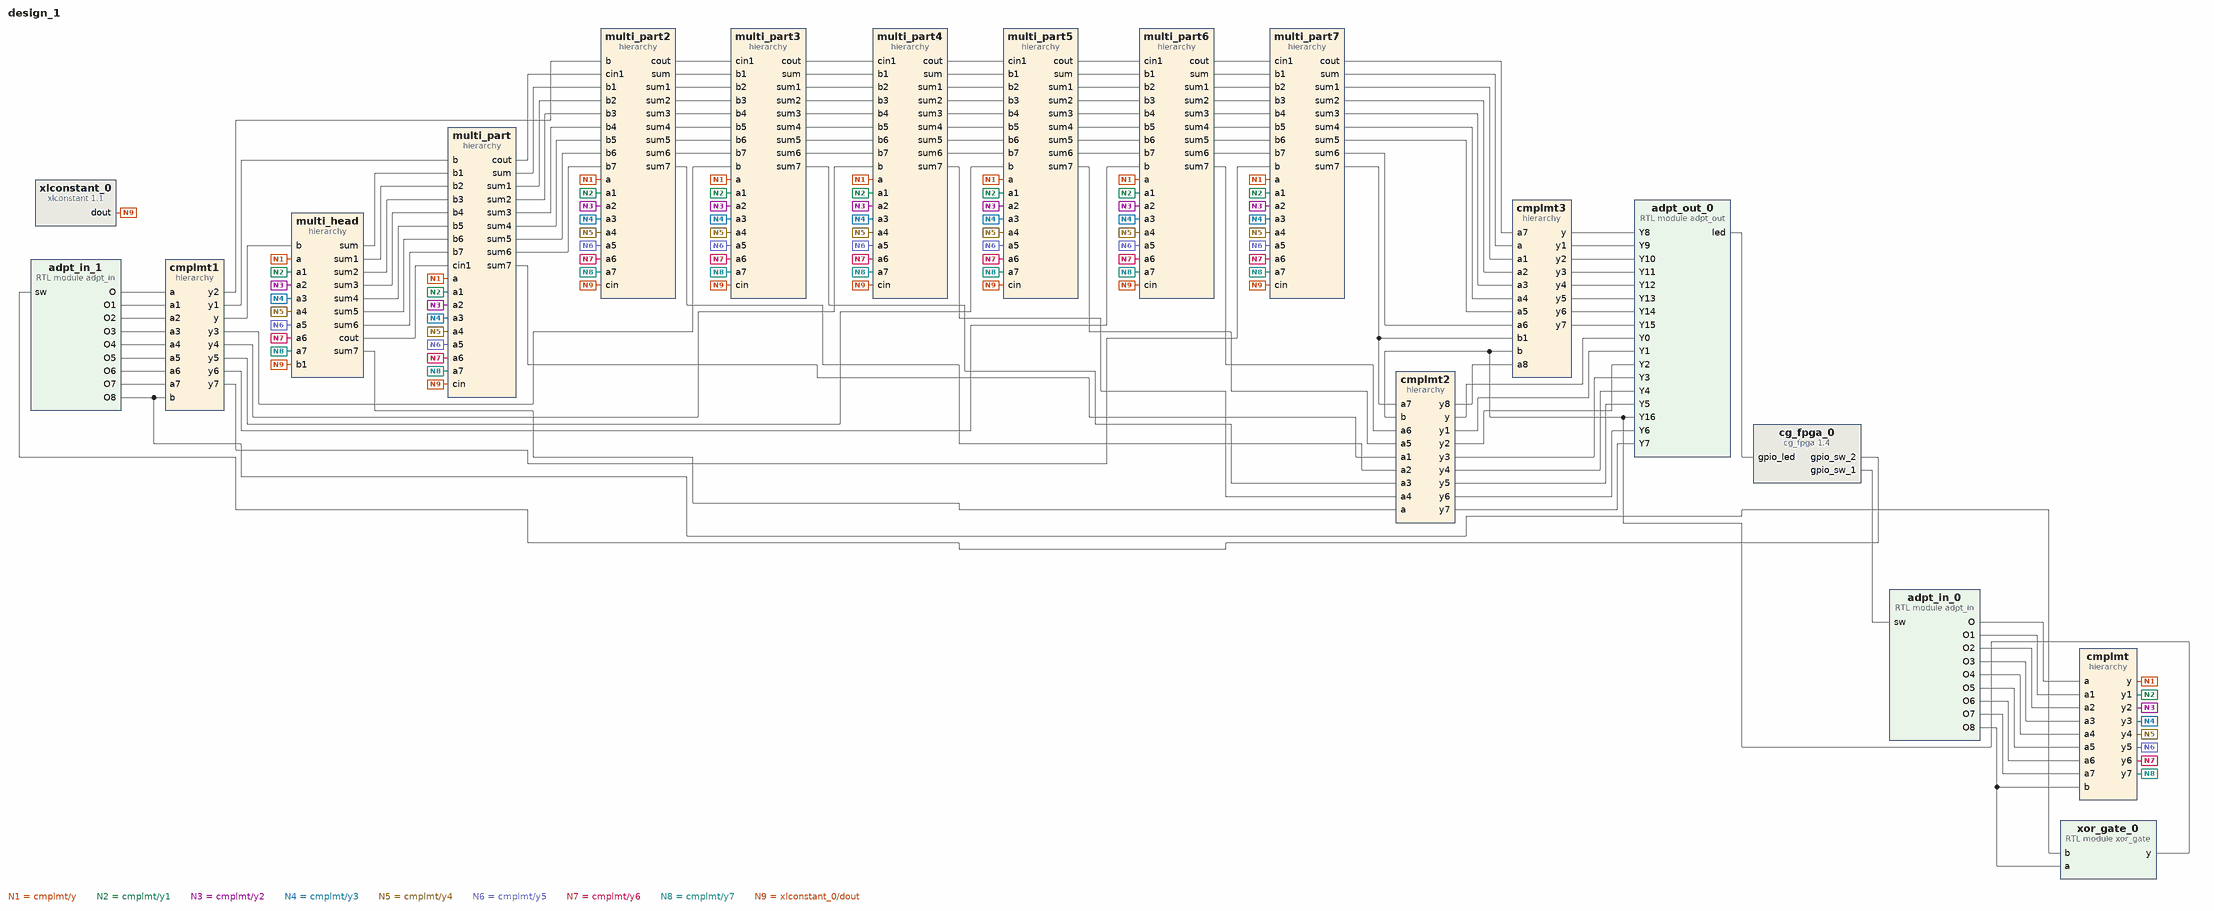
[diagram p0: block diagram of the top level]
# Vivado block design design_1, xc7z020clg400-1, Vivado 2024.2
create_bd_design design_1

create_bd_cell -type ip -vlnv educg.net:user:cg_fpga:1.4 cg_fpga_0
create_bd_cell -type module -reference adpt_in adpt_in_0
create_bd_cell -type module -reference adpt_in adpt_in_1
create_bd_cell -type hier cmplmt
create_bd_cell -type hier cmplmt1
create_bd_cell -type ip -vlnv xilinx.com:ip:xlconstant:1.1 xlconstant_0
set_property -dict {CONFIG.CONST_VAL 0} [get_bd_cells xlconstant_0]
create_bd_cell -type hier multi_part
create_bd_cell -type hier multi_head
create_bd_cell -type hier multi_part2
create_bd_cell -type hier multi_part3
create_bd_cell -type hier multi_part4
create_bd_cell -type hier multi_part5
create_bd_cell -type hier multi_part6
create_bd_cell -type hier multi_part7
create_bd_cell -type module -reference xor_gate xor_gate_0
create_bd_cell -type module -reference adpt_out adpt_out_0
create_bd_cell -type hier cmplmt2
create_bd_cell -type hier cmplmt3

# ---- hierarchy /cmplmt ----
current_bd_instance /cmplmt
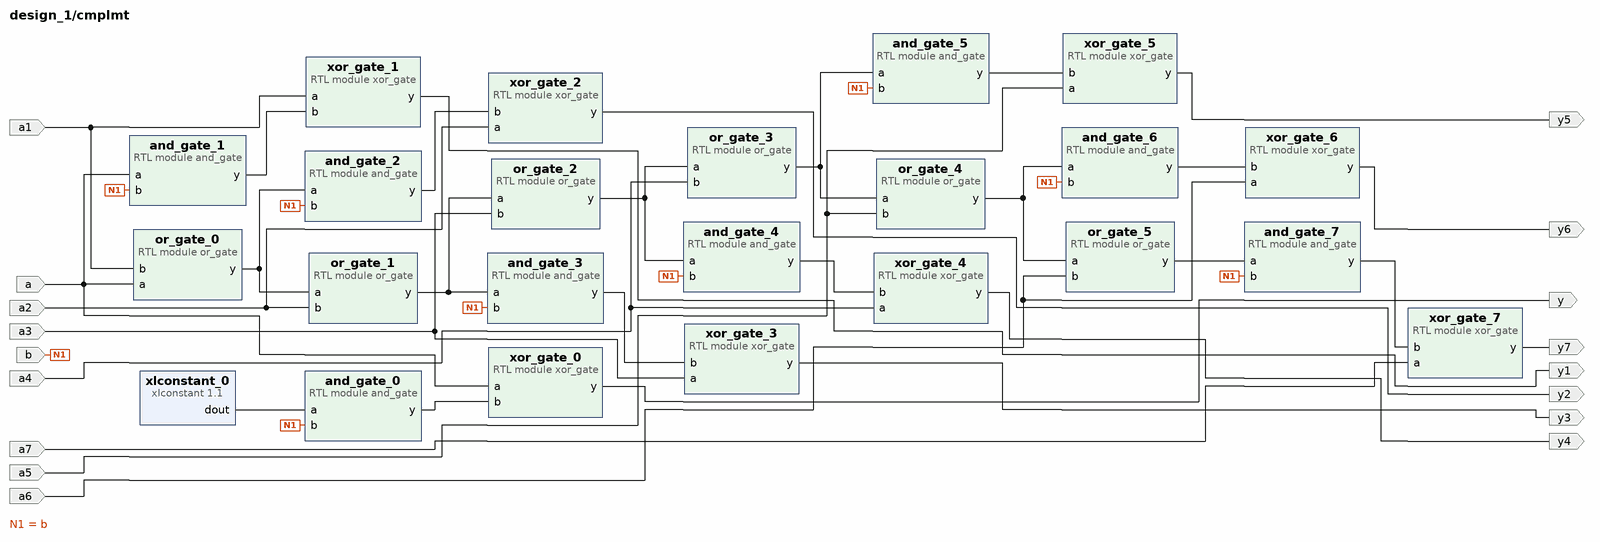
[diagram p1: block diagram inside /cmplmt]
create_bd_pin -dir I a
create_bd_pin -dir I a1
create_bd_pin -dir I a2
create_bd_pin -dir I a3
create_bd_pin -dir I a4
create_bd_pin -dir I a5
create_bd_pin -dir I b
create_bd_pin -dir I a6
create_bd_pin -dir I a7
create_bd_pin -dir O y
create_bd_pin -dir O y1
create_bd_pin -dir O y2
create_bd_pin -dir O y3
create_bd_pin -dir O y4
create_bd_pin -dir O y5
create_bd_pin -dir O y6
create_bd_pin -dir O y7

create_bd_cell -type ip -vlnv xilinx.com:ip:xlconstant:1.1 xlconstant_0
set_property -dict {CONFIG.CONST_VAL 0} [get_bd_cells xlconstant_0]
create_bd_cell -type module -reference or_gate or_gate_0
create_bd_cell -type module -reference or_gate or_gate_1
create_bd_cell -type module -reference or_gate or_gate_2
create_bd_cell -type module -reference or_gate or_gate_3
create_bd_cell -type module -reference or_gate or_gate_4
create_bd_cell -type module -reference and_gate and_gate_1
create_bd_cell -type module -reference and_gate and_gate_2
create_bd_cell -type module -reference and_gate and_gate_3
create_bd_cell -type module -reference and_gate and_gate_4
create_bd_cell -type module -reference and_gate and_gate_5
create_bd_cell -type module -reference and_gate and_gate_6
create_bd_cell -type module -reference xor_gate xor_gate_0
create_bd_cell -type module -reference xor_gate xor_gate_1
create_bd_cell -type module -reference xor_gate xor_gate_2
create_bd_cell -type module -reference xor_gate xor_gate_3
create_bd_cell -type module -reference xor_gate xor_gate_4
create_bd_cell -type module -reference xor_gate xor_gate_5
create_bd_cell -type module -reference xor_gate xor_gate_6
create_bd_cell -type module -reference xor_gate xor_gate_7
create_bd_cell -type module -reference or_gate or_gate_5
create_bd_cell -type module -reference and_gate and_gate_7
create_bd_cell -type module -reference and_gate and_gate_0

# ---- hierarchy /cmplmt1 ----
current_bd_instance /cmplmt1
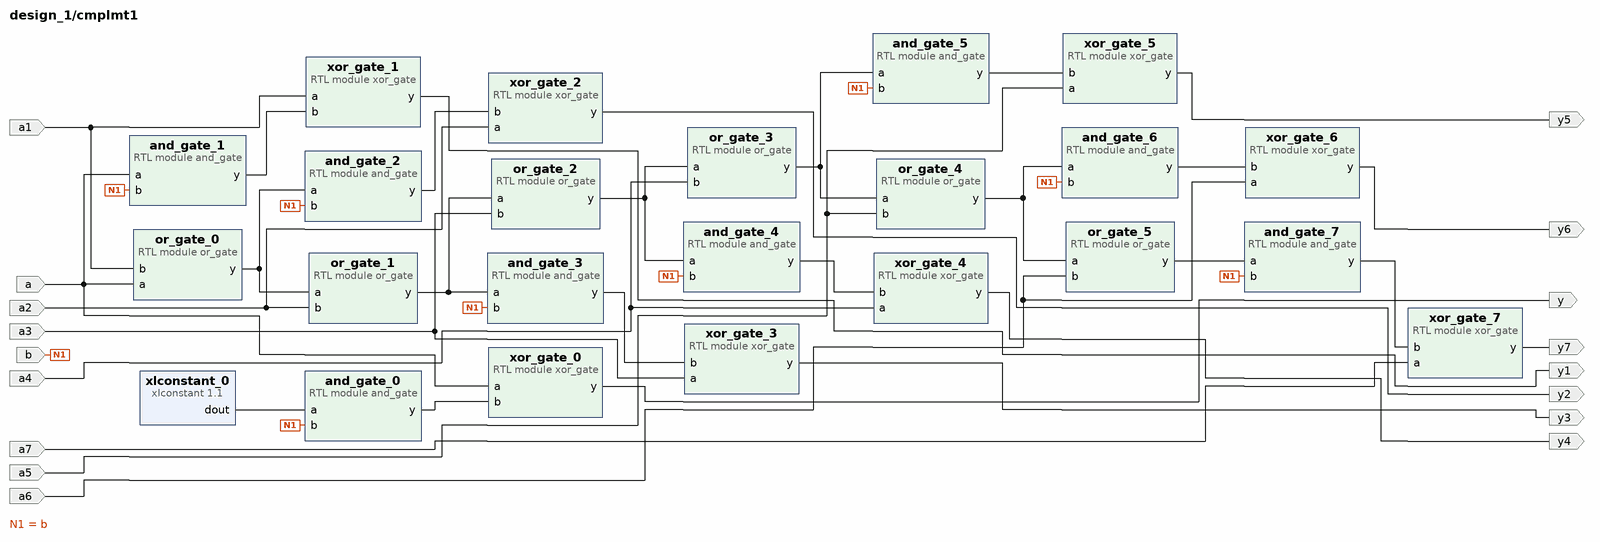
[diagram p2: block diagram inside /cmplmt1]
create_bd_pin -dir I a
create_bd_pin -dir I a1
create_bd_pin -dir I a2
create_bd_pin -dir I a3
create_bd_pin -dir I a4
create_bd_pin -dir I a5
create_bd_pin -dir I b
create_bd_pin -dir I a6
create_bd_pin -dir I a7
create_bd_pin -dir O y
create_bd_pin -dir O y1
create_bd_pin -dir O y2
create_bd_pin -dir O y3
create_bd_pin -dir O y4
create_bd_pin -dir O y5
create_bd_pin -dir O y6
create_bd_pin -dir O y7

create_bd_cell -type ip -vlnv xilinx.com:ip:xlconstant:1.1 xlconstant_0
set_property -dict {CONFIG.CONST_VAL 0} [get_bd_cells xlconstant_0]
create_bd_cell -type module -reference or_gate or_gate_0
create_bd_cell -type module -reference or_gate or_gate_1
create_bd_cell -type module -reference or_gate or_gate_2
create_bd_cell -type module -reference or_gate or_gate_3
create_bd_cell -type module -reference or_gate or_gate_4
create_bd_cell -type module -reference and_gate and_gate_1
create_bd_cell -type module -reference and_gate and_gate_2
create_bd_cell -type module -reference and_gate and_gate_3
create_bd_cell -type module -reference and_gate and_gate_4
create_bd_cell -type module -reference and_gate and_gate_5
create_bd_cell -type module -reference and_gate and_gate_6
create_bd_cell -type module -reference xor_gate xor_gate_0
create_bd_cell -type module -reference xor_gate xor_gate_1
create_bd_cell -type module -reference xor_gate xor_gate_2
create_bd_cell -type module -reference xor_gate xor_gate_3
create_bd_cell -type module -reference xor_gate xor_gate_4
create_bd_cell -type module -reference xor_gate xor_gate_5
create_bd_cell -type module -reference xor_gate xor_gate_6
create_bd_cell -type module -reference xor_gate xor_gate_7
create_bd_cell -type module -reference or_gate or_gate_5
create_bd_cell -type module -reference and_gate and_gate_7
create_bd_cell -type module -reference and_gate and_gate_0

# ---- hierarchy /multi_part ----
current_bd_instance /multi_part
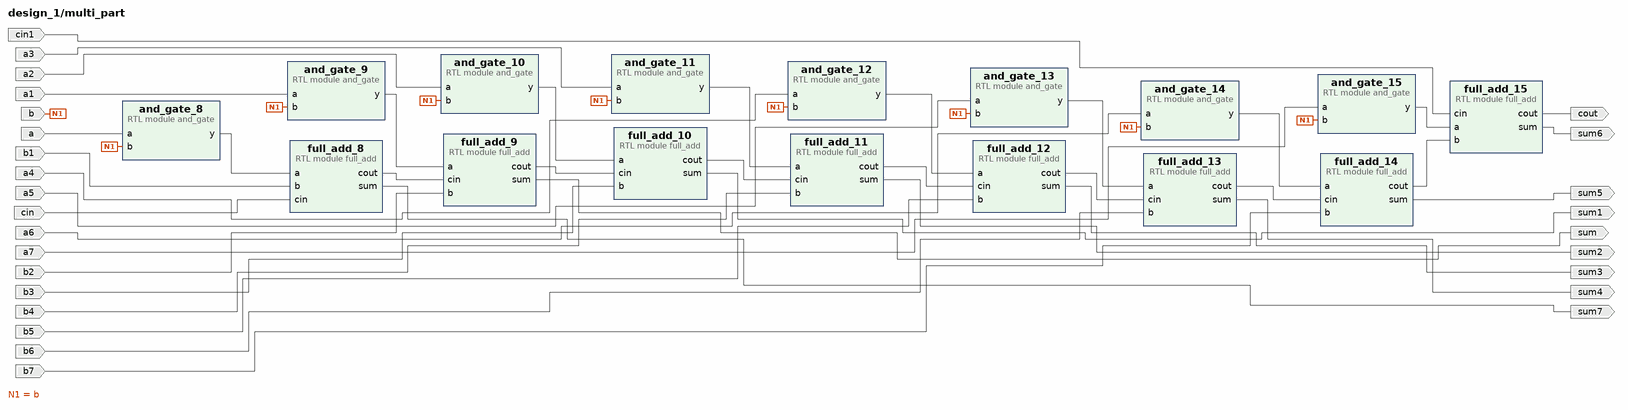
[diagram p3: block diagram inside /multi_part]
create_bd_pin -dir I a
create_bd_pin -dir I b
create_bd_pin -dir I a1
create_bd_pin -dir I a2
create_bd_pin -dir I a3
create_bd_pin -dir I a4
create_bd_pin -dir I a5
create_bd_pin -dir I a6
create_bd_pin -dir I a7
create_bd_pin -dir I b1
create_bd_pin -dir I cin
create_bd_pin -dir I b2
create_bd_pin -dir I b3
create_bd_pin -dir I b4
create_bd_pin -dir I b5
create_bd_pin -dir I b6
create_bd_pin -dir I b7
create_bd_pin -dir O sum
create_bd_pin -dir O sum1
create_bd_pin -dir O sum2
create_bd_pin -dir O sum3
create_bd_pin -dir O sum4
create_bd_pin -dir O sum5
create_bd_pin -dir O sum6
create_bd_pin -dir O cout
create_bd_pin -dir I cin1
create_bd_pin -dir O sum7

create_bd_cell -type module -reference and_gate and_gate_8
create_bd_cell -type module -reference and_gate and_gate_9
create_bd_cell -type module -reference and_gate and_gate_10
create_bd_cell -type module -reference and_gate and_gate_11
create_bd_cell -type module -reference and_gate and_gate_12
create_bd_cell -type module -reference and_gate and_gate_13
create_bd_cell -type module -reference and_gate and_gate_14
create_bd_cell -type module -reference and_gate and_gate_15
create_bd_cell -type module -reference full_add full_add_8
create_bd_cell -type module -reference full_add full_add_9
create_bd_cell -type module -reference full_add full_add_10
create_bd_cell -type module -reference full_add full_add_11
create_bd_cell -type module -reference full_add full_add_12
create_bd_cell -type module -reference full_add full_add_13
create_bd_cell -type module -reference full_add full_add_14
create_bd_cell -type module -reference full_add full_add_15

# ---- hierarchy /multi_head ----
current_bd_instance /multi_head
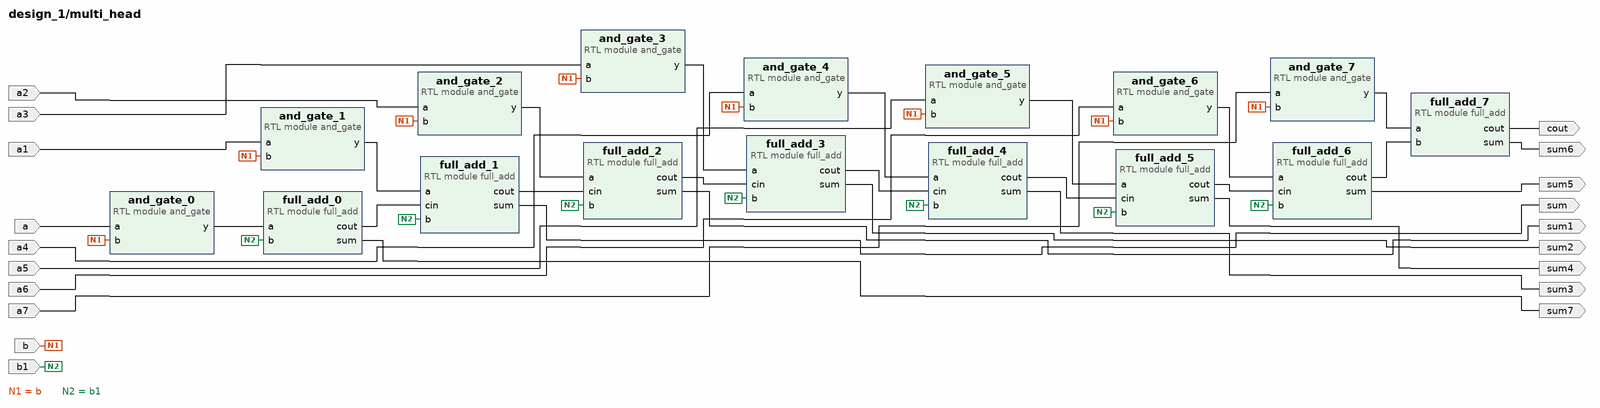
[diagram p4: block diagram inside /multi_head]
create_bd_pin -dir I a
create_bd_pin -dir I b
create_bd_pin -dir I a1
create_bd_pin -dir I a2
create_bd_pin -dir I a3
create_bd_pin -dir I a4
create_bd_pin -dir I a5
create_bd_pin -dir I a6
create_bd_pin -dir I a7
create_bd_pin -dir I b1
create_bd_pin -dir O sum
create_bd_pin -dir O sum1
create_bd_pin -dir O sum2
create_bd_pin -dir O sum3
create_bd_pin -dir O sum4
create_bd_pin -dir O sum5
create_bd_pin -dir O sum6
create_bd_pin -dir O cout
create_bd_pin -dir O sum7

create_bd_cell -type module -reference and_gate and_gate_0
create_bd_cell -type module -reference and_gate and_gate_1
create_bd_cell -type module -reference and_gate and_gate_2
create_bd_cell -type module -reference and_gate and_gate_3
create_bd_cell -type module -reference and_gate and_gate_4
create_bd_cell -type module -reference and_gate and_gate_5
create_bd_cell -type module -reference and_gate and_gate_6
create_bd_cell -type module -reference and_gate and_gate_7
create_bd_cell -type module -reference full_add full_add_0
create_bd_cell -type module -reference full_add full_add_1
create_bd_cell -type module -reference full_add full_add_2
create_bd_cell -type module -reference full_add full_add_3
create_bd_cell -type module -reference full_add full_add_4
create_bd_cell -type module -reference full_add full_add_5
create_bd_cell -type module -reference full_add full_add_6
create_bd_cell -type module -reference full_add full_add_7

# ---- hierarchy /multi_part2 ----
current_bd_instance /multi_part2
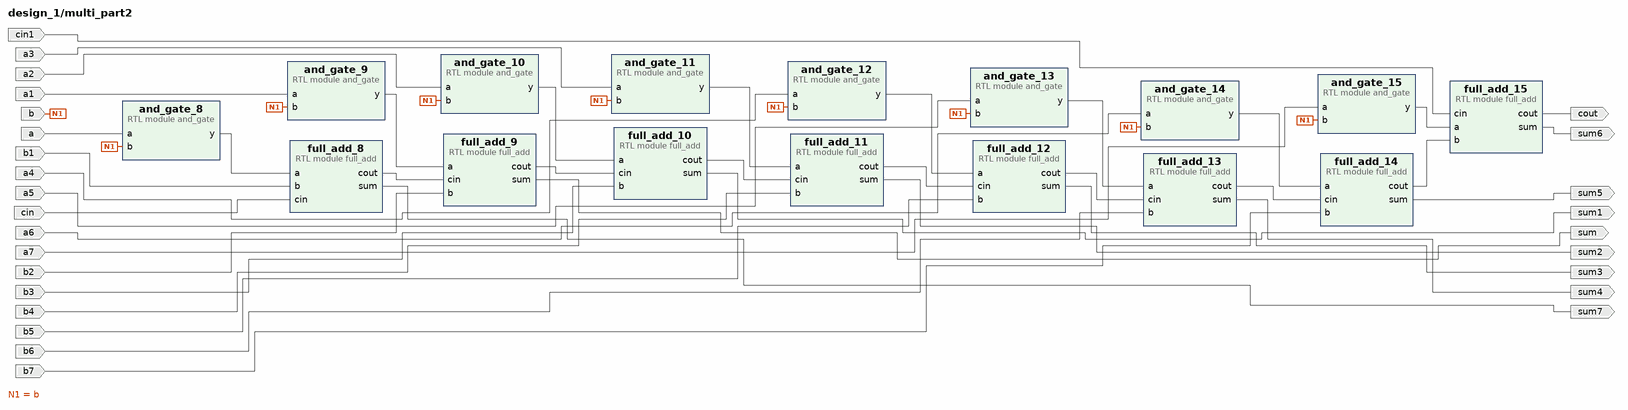
[diagram p5: block diagram inside /multi_part2]
create_bd_pin -dir I a
create_bd_pin -dir I b
create_bd_pin -dir I a1
create_bd_pin -dir I a2
create_bd_pin -dir I a3
create_bd_pin -dir I a4
create_bd_pin -dir I a5
create_bd_pin -dir I a6
create_bd_pin -dir I a7
create_bd_pin -dir I b1
create_bd_pin -dir I cin
create_bd_pin -dir I b2
create_bd_pin -dir I b3
create_bd_pin -dir I b4
create_bd_pin -dir I b5
create_bd_pin -dir I b6
create_bd_pin -dir I b7
create_bd_pin -dir O sum
create_bd_pin -dir O sum1
create_bd_pin -dir O sum2
create_bd_pin -dir O sum3
create_bd_pin -dir O sum4
create_bd_pin -dir O sum5
create_bd_pin -dir O sum6
create_bd_pin -dir O cout
create_bd_pin -dir I cin1
create_bd_pin -dir O sum7

create_bd_cell -type module -reference and_gate and_gate_8
create_bd_cell -type module -reference and_gate and_gate_9
create_bd_cell -type module -reference and_gate and_gate_10
create_bd_cell -type module -reference and_gate and_gate_11
create_bd_cell -type module -reference and_gate and_gate_12
create_bd_cell -type module -reference and_gate and_gate_13
create_bd_cell -type module -reference and_gate and_gate_14
create_bd_cell -type module -reference and_gate and_gate_15
create_bd_cell -type module -reference full_add full_add_8
create_bd_cell -type module -reference full_add full_add_9
create_bd_cell -type module -reference full_add full_add_10
create_bd_cell -type module -reference full_add full_add_11
create_bd_cell -type module -reference full_add full_add_12
create_bd_cell -type module -reference full_add full_add_13
create_bd_cell -type module -reference full_add full_add_14
create_bd_cell -type module -reference full_add full_add_15

# ---- hierarchy /multi_part3 ----
current_bd_instance /multi_part3
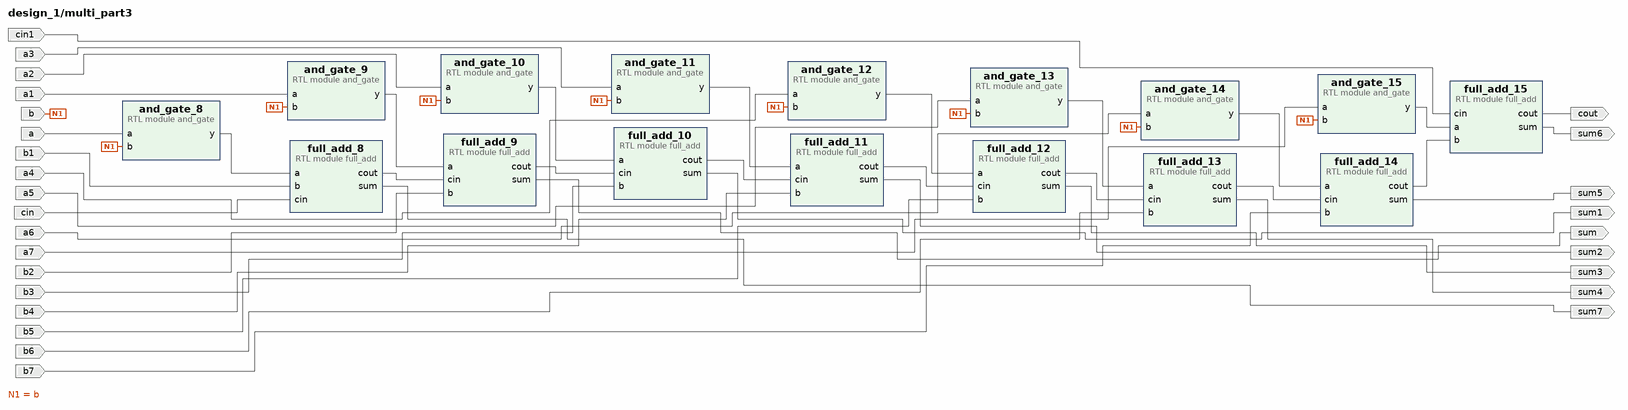
[diagram p6: block diagram inside /multi_part3]
create_bd_pin -dir I a
create_bd_pin -dir I b
create_bd_pin -dir I a1
create_bd_pin -dir I a2
create_bd_pin -dir I a3
create_bd_pin -dir I a4
create_bd_pin -dir I a5
create_bd_pin -dir I a6
create_bd_pin -dir I a7
create_bd_pin -dir I b1
create_bd_pin -dir I cin
create_bd_pin -dir I b2
create_bd_pin -dir I b3
create_bd_pin -dir I b4
create_bd_pin -dir I b5
create_bd_pin -dir I b6
create_bd_pin -dir I b7
create_bd_pin -dir O sum
create_bd_pin -dir O sum1
create_bd_pin -dir O sum2
create_bd_pin -dir O sum3
create_bd_pin -dir O sum4
create_bd_pin -dir O sum5
create_bd_pin -dir O sum6
create_bd_pin -dir O cout
create_bd_pin -dir I cin1
create_bd_pin -dir O sum7

create_bd_cell -type module -reference and_gate and_gate_8
create_bd_cell -type module -reference and_gate and_gate_9
create_bd_cell -type module -reference and_gate and_gate_10
create_bd_cell -type module -reference and_gate and_gate_11
create_bd_cell -type module -reference and_gate and_gate_12
create_bd_cell -type module -reference and_gate and_gate_13
create_bd_cell -type module -reference and_gate and_gate_14
create_bd_cell -type module -reference and_gate and_gate_15
create_bd_cell -type module -reference full_add full_add_8
create_bd_cell -type module -reference full_add full_add_9
create_bd_cell -type module -reference full_add full_add_10
create_bd_cell -type module -reference full_add full_add_11
create_bd_cell -type module -reference full_add full_add_12
create_bd_cell -type module -reference full_add full_add_13
create_bd_cell -type module -reference full_add full_add_14
create_bd_cell -type module -reference full_add full_add_15

# ---- hierarchy /multi_part4 ----
current_bd_instance /multi_part4
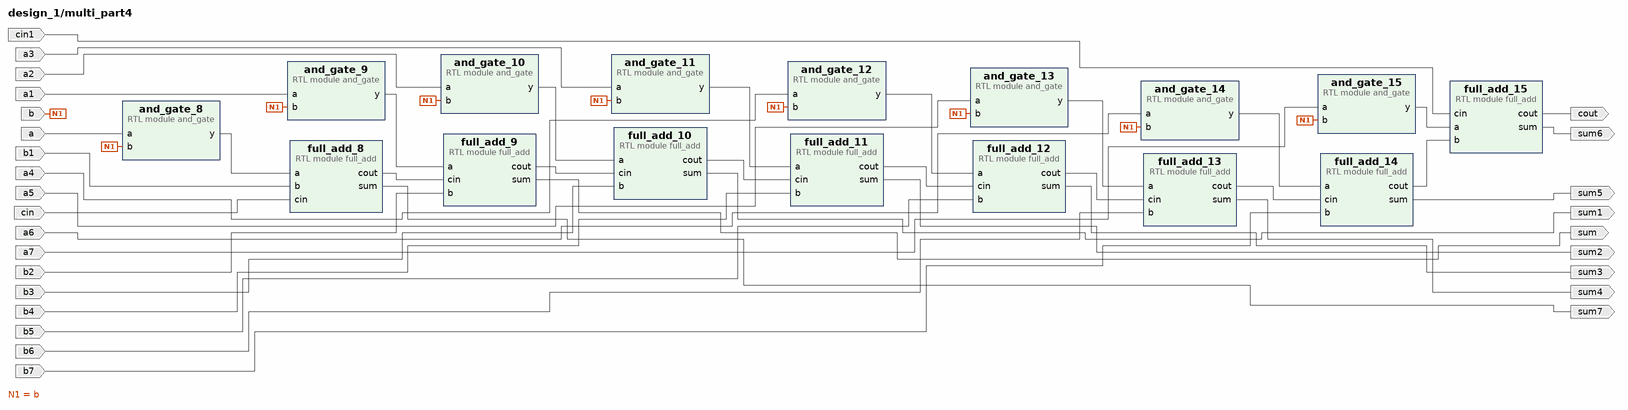
[diagram p7: block diagram inside /multi_part4]
create_bd_pin -dir I a
create_bd_pin -dir I b
create_bd_pin -dir I a1
create_bd_pin -dir I a2
create_bd_pin -dir I a3
create_bd_pin -dir I a4
create_bd_pin -dir I a5
create_bd_pin -dir I a6
create_bd_pin -dir I a7
create_bd_pin -dir I b1
create_bd_pin -dir I cin
create_bd_pin -dir I b2
create_bd_pin -dir I b3
create_bd_pin -dir I b4
create_bd_pin -dir I b5
create_bd_pin -dir I b6
create_bd_pin -dir I b7
create_bd_pin -dir O sum
create_bd_pin -dir O sum1
create_bd_pin -dir O sum2
create_bd_pin -dir O sum3
create_bd_pin -dir O sum4
create_bd_pin -dir O sum5
create_bd_pin -dir O sum6
create_bd_pin -dir O cout
create_bd_pin -dir I cin1
create_bd_pin -dir O sum7

create_bd_cell -type module -reference and_gate and_gate_8
create_bd_cell -type module -reference and_gate and_gate_9
create_bd_cell -type module -reference and_gate and_gate_10
create_bd_cell -type module -reference and_gate and_gate_11
create_bd_cell -type module -reference and_gate and_gate_12
create_bd_cell -type module -reference and_gate and_gate_13
create_bd_cell -type module -reference and_gate and_gate_14
create_bd_cell -type module -reference and_gate and_gate_15
create_bd_cell -type module -reference full_add full_add_8
create_bd_cell -type module -reference full_add full_add_9
create_bd_cell -type module -reference full_add full_add_10
create_bd_cell -type module -reference full_add full_add_11
create_bd_cell -type module -reference full_add full_add_12
create_bd_cell -type module -reference full_add full_add_13
create_bd_cell -type module -reference full_add full_add_14
create_bd_cell -type module -reference full_add full_add_15

# ---- hierarchy /multi_part5 ----
current_bd_instance /multi_part5
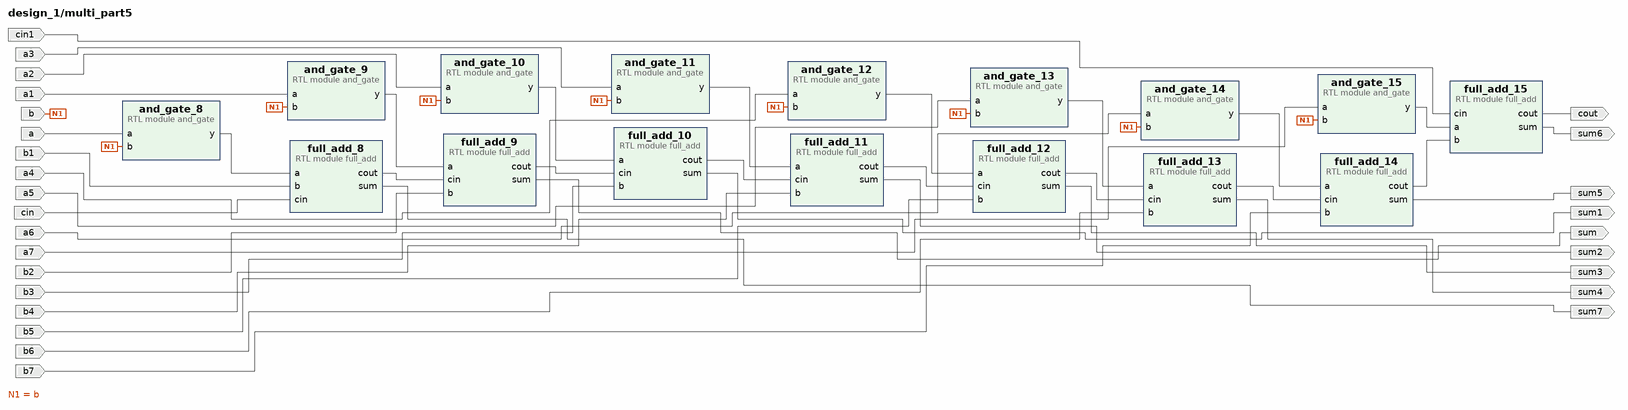
[diagram p8: block diagram inside /multi_part5]
create_bd_pin -dir I a
create_bd_pin -dir I b
create_bd_pin -dir I a1
create_bd_pin -dir I a2
create_bd_pin -dir I a3
create_bd_pin -dir I a4
create_bd_pin -dir I a5
create_bd_pin -dir I a6
create_bd_pin -dir I a7
create_bd_pin -dir I b1
create_bd_pin -dir I cin
create_bd_pin -dir I b2
create_bd_pin -dir I b3
create_bd_pin -dir I b4
create_bd_pin -dir I b5
create_bd_pin -dir I b6
create_bd_pin -dir I b7
create_bd_pin -dir O sum
create_bd_pin -dir O sum1
create_bd_pin -dir O sum2
create_bd_pin -dir O sum3
create_bd_pin -dir O sum4
create_bd_pin -dir O sum5
create_bd_pin -dir O sum6
create_bd_pin -dir O cout
create_bd_pin -dir I cin1
create_bd_pin -dir O sum7

create_bd_cell -type module -reference and_gate and_gate_8
create_bd_cell -type module -reference and_gate and_gate_9
create_bd_cell -type module -reference and_gate and_gate_10
create_bd_cell -type module -reference and_gate and_gate_11
create_bd_cell -type module -reference and_gate and_gate_12
create_bd_cell -type module -reference and_gate and_gate_13
create_bd_cell -type module -reference and_gate and_gate_14
create_bd_cell -type module -reference and_gate and_gate_15
create_bd_cell -type module -reference full_add full_add_8
create_bd_cell -type module -reference full_add full_add_9
create_bd_cell -type module -reference full_add full_add_10
create_bd_cell -type module -reference full_add full_add_11
create_bd_cell -type module -reference full_add full_add_12
create_bd_cell -type module -reference full_add full_add_13
create_bd_cell -type module -reference full_add full_add_14
create_bd_cell -type module -reference full_add full_add_15

# ---- hierarchy /multi_part6 ----
current_bd_instance /multi_part6
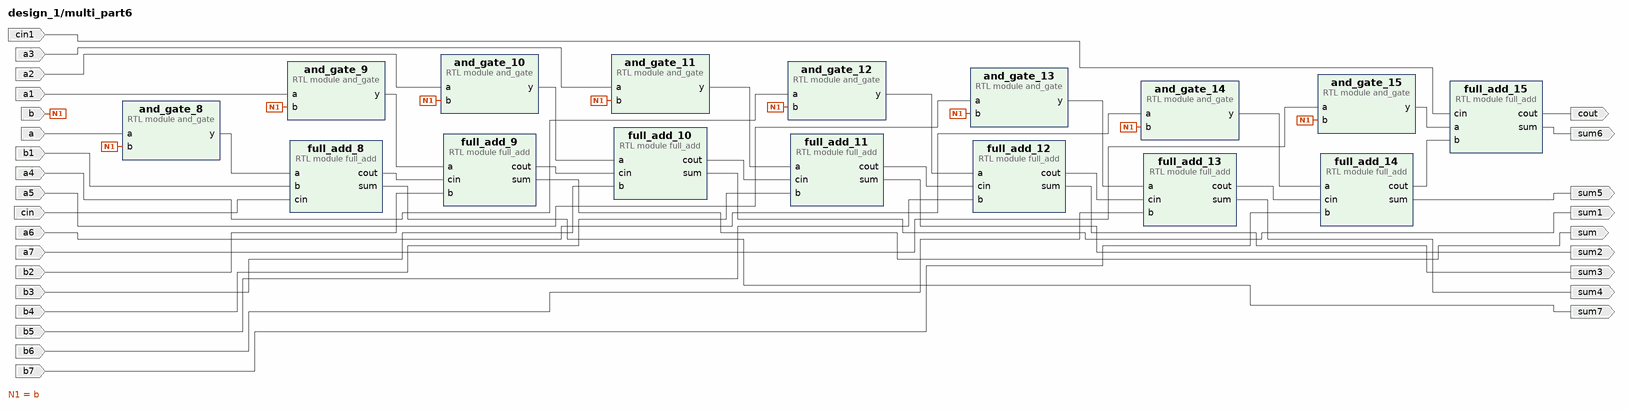
[diagram p9: block diagram inside /multi_part6]
create_bd_pin -dir I a
create_bd_pin -dir I b
create_bd_pin -dir I a1
create_bd_pin -dir I a2
create_bd_pin -dir I a3
create_bd_pin -dir I a4
create_bd_pin -dir I a5
create_bd_pin -dir I a6
create_bd_pin -dir I a7
create_bd_pin -dir I b1
create_bd_pin -dir I cin
create_bd_pin -dir I b2
create_bd_pin -dir I b3
create_bd_pin -dir I b4
create_bd_pin -dir I b5
create_bd_pin -dir I b6
create_bd_pin -dir I b7
create_bd_pin -dir O sum
create_bd_pin -dir O sum1
create_bd_pin -dir O sum2
create_bd_pin -dir O sum3
create_bd_pin -dir O sum4
create_bd_pin -dir O sum5
create_bd_pin -dir O sum6
create_bd_pin -dir O cout
create_bd_pin -dir I cin1
create_bd_pin -dir O sum7

create_bd_cell -type module -reference and_gate and_gate_8
create_bd_cell -type module -reference and_gate and_gate_9
create_bd_cell -type module -reference and_gate and_gate_10
create_bd_cell -type module -reference and_gate and_gate_11
create_bd_cell -type module -reference and_gate and_gate_12
create_bd_cell -type module -reference and_gate and_gate_13
create_bd_cell -type module -reference and_gate and_gate_14
create_bd_cell -type module -reference and_gate and_gate_15
create_bd_cell -type module -reference full_add full_add_8
create_bd_cell -type module -reference full_add full_add_9
create_bd_cell -type module -reference full_add full_add_10
create_bd_cell -type module -reference full_add full_add_11
create_bd_cell -type module -reference full_add full_add_12
create_bd_cell -type module -reference full_add full_add_13
create_bd_cell -type module -reference full_add full_add_14
create_bd_cell -type module -reference full_add full_add_15

# ---- hierarchy /multi_part7 ----
current_bd_instance /multi_part7
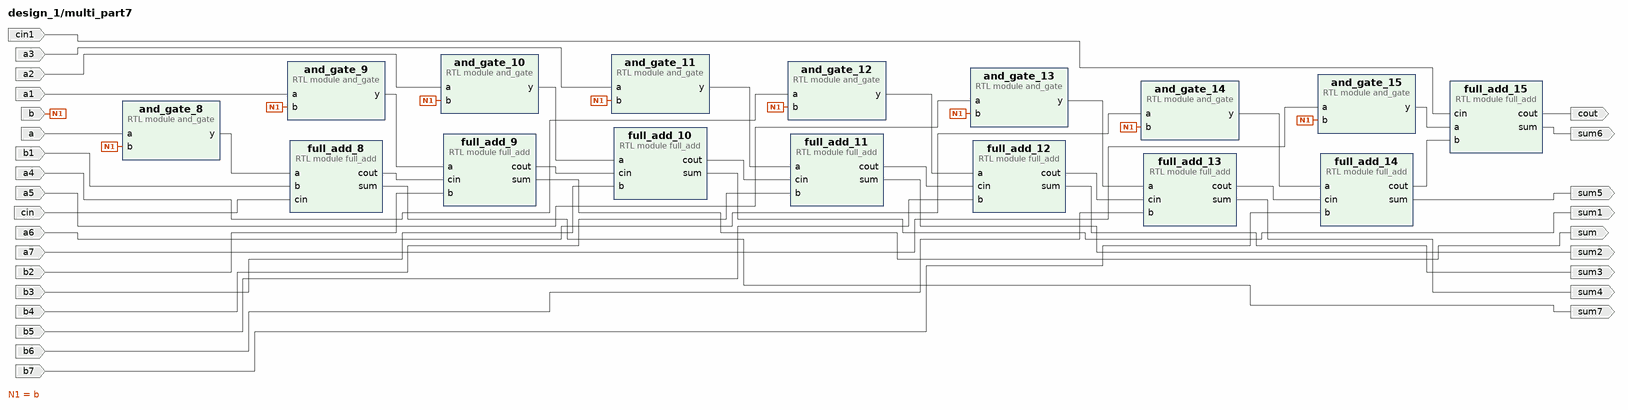
[diagram p10: block diagram inside /multi_part7]
create_bd_pin -dir I a
create_bd_pin -dir I b
create_bd_pin -dir I a1
create_bd_pin -dir I a2
create_bd_pin -dir I a3
create_bd_pin -dir I a4
create_bd_pin -dir I a5
create_bd_pin -dir I a6
create_bd_pin -dir I a7
create_bd_pin -dir I b1
create_bd_pin -dir I cin
create_bd_pin -dir I b2
create_bd_pin -dir I b3
create_bd_pin -dir I b4
create_bd_pin -dir I b5
create_bd_pin -dir I b6
create_bd_pin -dir I b7
create_bd_pin -dir O sum
create_bd_pin -dir O sum1
create_bd_pin -dir O sum2
create_bd_pin -dir O sum3
create_bd_pin -dir O sum4
create_bd_pin -dir O sum5
create_bd_pin -dir O sum6
create_bd_pin -dir O cout
create_bd_pin -dir I cin1
create_bd_pin -dir O sum7

create_bd_cell -type module -reference and_gate and_gate_8
create_bd_cell -type module -reference and_gate and_gate_9
create_bd_cell -type module -reference and_gate and_gate_10
create_bd_cell -type module -reference and_gate and_gate_11
create_bd_cell -type module -reference and_gate and_gate_12
create_bd_cell -type module -reference and_gate and_gate_13
create_bd_cell -type module -reference and_gate and_gate_14
create_bd_cell -type module -reference and_gate and_gate_15
create_bd_cell -type module -reference full_add full_add_8
create_bd_cell -type module -reference full_add full_add_9
create_bd_cell -type module -reference full_add full_add_10
create_bd_cell -type module -reference full_add full_add_11
create_bd_cell -type module -reference full_add full_add_12
create_bd_cell -type module -reference full_add full_add_13
create_bd_cell -type module -reference full_add full_add_14
create_bd_cell -type module -reference full_add full_add_15

# ---- hierarchy /cmplmt2 ----
current_bd_instance /cmplmt2
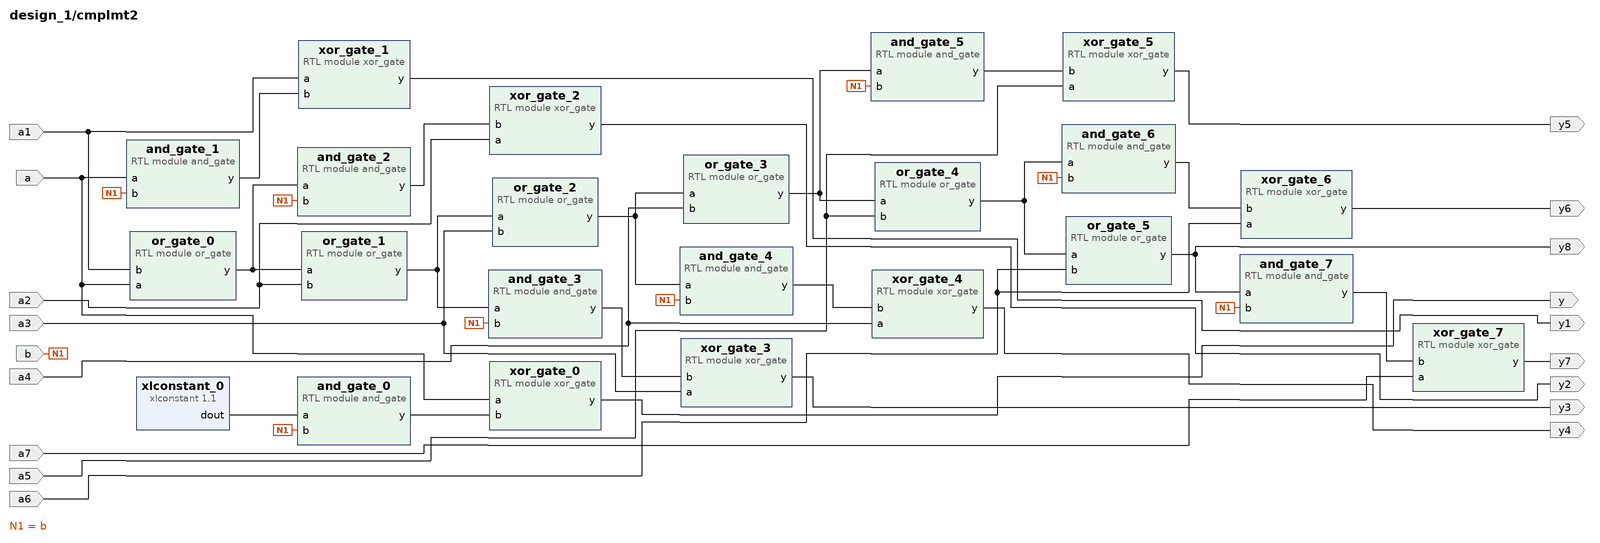
[diagram p11: block diagram inside /cmplmt2]
create_bd_pin -dir I a
create_bd_pin -dir I a1
create_bd_pin -dir I a2
create_bd_pin -dir I a3
create_bd_pin -dir I a4
create_bd_pin -dir I a5
create_bd_pin -dir I b
create_bd_pin -dir I a6
create_bd_pin -dir I a7
create_bd_pin -dir O y
create_bd_pin -dir O y1
create_bd_pin -dir O y2
create_bd_pin -dir O y3
create_bd_pin -dir O y4
create_bd_pin -dir O y5
create_bd_pin -dir O y6
create_bd_pin -dir O y7
create_bd_pin -dir O y8

create_bd_cell -type ip -vlnv xilinx.com:ip:xlconstant:1.1 xlconstant_0
set_property -dict {CONFIG.CONST_VAL 0} [get_bd_cells xlconstant_0]
create_bd_cell -type module -reference or_gate or_gate_0
create_bd_cell -type module -reference or_gate or_gate_1
create_bd_cell -type module -reference or_gate or_gate_2
create_bd_cell -type module -reference or_gate or_gate_3
create_bd_cell -type module -reference or_gate or_gate_4
create_bd_cell -type module -reference and_gate and_gate_1
create_bd_cell -type module -reference and_gate and_gate_2
create_bd_cell -type module -reference and_gate and_gate_3
create_bd_cell -type module -reference and_gate and_gate_4
create_bd_cell -type module -reference and_gate and_gate_5
create_bd_cell -type module -reference and_gate and_gate_6
create_bd_cell -type module -reference xor_gate xor_gate_0
create_bd_cell -type module -reference xor_gate xor_gate_1
create_bd_cell -type module -reference xor_gate xor_gate_2
create_bd_cell -type module -reference xor_gate xor_gate_3
create_bd_cell -type module -reference xor_gate xor_gate_4
create_bd_cell -type module -reference xor_gate xor_gate_5
create_bd_cell -type module -reference xor_gate xor_gate_6
create_bd_cell -type module -reference xor_gate xor_gate_7
create_bd_cell -type module -reference or_gate or_gate_5
create_bd_cell -type module -reference and_gate and_gate_7
create_bd_cell -type module -reference and_gate and_gate_0

# ---- hierarchy /cmplmt3 ----
current_bd_instance /cmplmt3
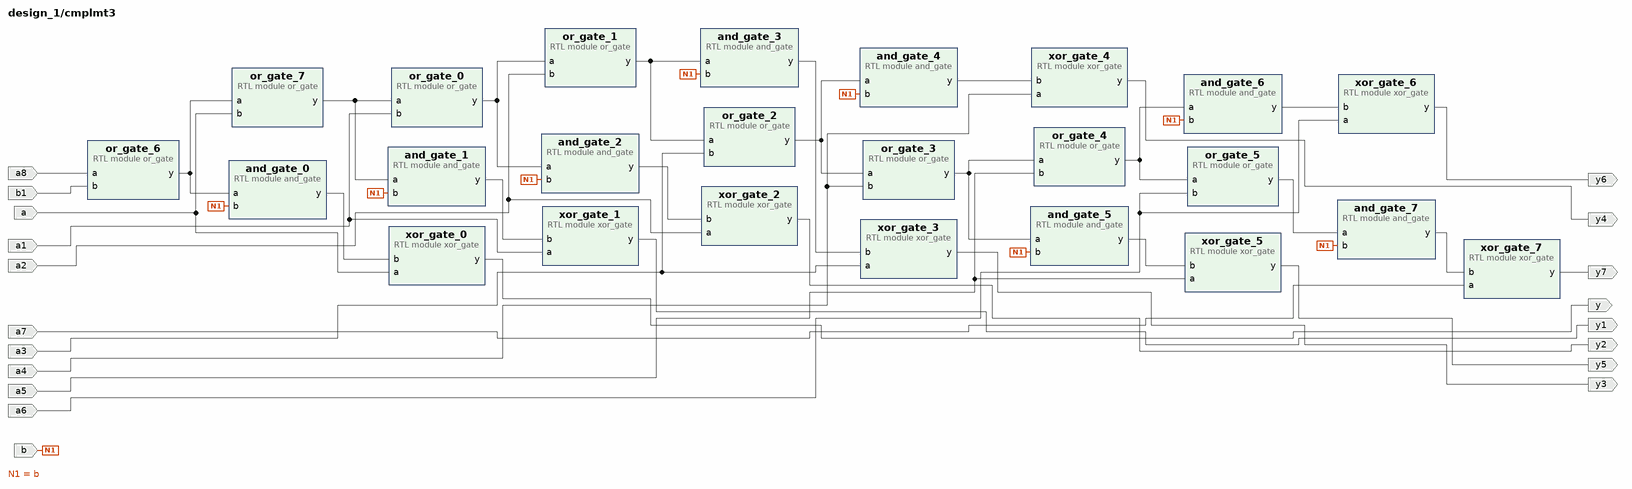
[diagram p12: block diagram inside /cmplmt3]
create_bd_pin -dir I a
create_bd_pin -dir I a1
create_bd_pin -dir I a2
create_bd_pin -dir I a3
create_bd_pin -dir I a4
create_bd_pin -dir I a5
create_bd_pin -dir I b
create_bd_pin -dir I a6
create_bd_pin -dir I a7
create_bd_pin -dir O y
create_bd_pin -dir O y1
create_bd_pin -dir O y2
create_bd_pin -dir O y3
create_bd_pin -dir O y4
create_bd_pin -dir O y5
create_bd_pin -dir O y6
create_bd_pin -dir O y7
create_bd_pin -dir I a8
create_bd_pin -dir I b1

create_bd_cell -type module -reference or_gate or_gate_0
create_bd_cell -type module -reference or_gate or_gate_1
create_bd_cell -type module -reference or_gate or_gate_2
create_bd_cell -type module -reference or_gate or_gate_3
create_bd_cell -type module -reference or_gate or_gate_4
create_bd_cell -type module -reference and_gate and_gate_1
create_bd_cell -type module -reference and_gate and_gate_2
create_bd_cell -type module -reference and_gate and_gate_3
create_bd_cell -type module -reference and_gate and_gate_4
create_bd_cell -type module -reference and_gate and_gate_5
create_bd_cell -type module -reference and_gate and_gate_6
create_bd_cell -type module -reference xor_gate xor_gate_0
create_bd_cell -type module -reference xor_gate xor_gate_1
create_bd_cell -type module -reference xor_gate xor_gate_2
create_bd_cell -type module -reference xor_gate xor_gate_3
create_bd_cell -type module -reference xor_gate xor_gate_4
create_bd_cell -type module -reference xor_gate xor_gate_5
create_bd_cell -type module -reference xor_gate xor_gate_6
create_bd_cell -type module -reference xor_gate xor_gate_7
create_bd_cell -type module -reference or_gate or_gate_5
create_bd_cell -type module -reference and_gate and_gate_7
create_bd_cell -type module -reference and_gate and_gate_0
create_bd_cell -type module -reference or_gate or_gate_6
create_bd_cell -type module -reference or_gate or_gate_7

# ---- connections ----

current_bd_instance /cmplmt
connect_bd_net [get_bd_pins b] \
  [get_bd_pins and_gate_1/b] [get_bd_pins and_gate_2/b] [get_bd_pins and_gate_3/b] [get_bd_pins and_gate_4/b] \
  [get_bd_pins and_gate_5/b] [get_bd_pins and_gate_6/b] [get_bd_pins and_gate_7/b] [get_bd_pins and_gate_0/b]
connect_bd_net -net a7_1 [get_bd_pins a7] [get_bd_pins xor_gate_7/a]
connect_bd_net -net adpt_in_0_O [get_bd_pins a] [get_bd_pins and_gate_1/a] [get_bd_pins xor_gate_0/a] [get_bd_pins or_gate_0/a]
connect_bd_net -net adpt_in_0_O1 [get_bd_pins a1] [get_bd_pins xor_gate_1/a] [get_bd_pins or_gate_0/b]
connect_bd_net -net adpt_in_0_O2 [get_bd_pins a2] [get_bd_pins xor_gate_2/a] [get_bd_pins or_gate_1/b]
connect_bd_net -net adpt_in_0_O3 [get_bd_pins a3] [get_bd_pins xor_gate_3/a] [get_bd_pins or_gate_2/b]
connect_bd_net -net adpt_in_0_O4 [get_bd_pins a4] [get_bd_pins xor_gate_4/a] [get_bd_pins or_gate_3/b]
connect_bd_net -net adpt_in_0_O5 [get_bd_pins a5] [get_bd_pins xor_gate_5/a] [get_bd_pins or_gate_4/b]
connect_bd_net -net adpt_in_0_O6 [get_bd_pins a6] [get_bd_pins xor_gate_6/a] [get_bd_pins or_gate_5/b]
connect_bd_net [get_bd_pins and_gate_0/y] [get_bd_pins xor_gate_0/b]
connect_bd_net [get_bd_pins and_gate_1/y] [get_bd_pins xor_gate_1/b]
connect_bd_net [get_bd_pins and_gate_2/y] [get_bd_pins xor_gate_2/b]
connect_bd_net [get_bd_pins and_gate_3/y] [get_bd_pins xor_gate_3/b]
connect_bd_net [get_bd_pins and_gate_4/y] [get_bd_pins xor_gate_4/b]
connect_bd_net [get_bd_pins and_gate_5/y] [get_bd_pins xor_gate_5/b]
connect_bd_net [get_bd_pins and_gate_6/y] [get_bd_pins xor_gate_6/b]
connect_bd_net [get_bd_pins and_gate_7/y] [get_bd_pins xor_gate_7/b]
connect_bd_net [get_bd_pins or_gate_0/y] [get_bd_pins and_gate_2/a] [get_bd_pins or_gate_1/a]
connect_bd_net [get_bd_pins or_gate_1/y] [get_bd_pins and_gate_3/a] [get_bd_pins or_gate_2/a]
connect_bd_net [get_bd_pins or_gate_2/y] [get_bd_pins and_gate_4/a] [get_bd_pins or_gate_3/a]
connect_bd_net [get_bd_pins or_gate_3/y] [get_bd_pins and_gate_5/a] [get_bd_pins or_gate_4/a]
connect_bd_net [get_bd_pins or_gate_4/y] [get_bd_pins and_gate_6/a] [get_bd_pins or_gate_5/a]
connect_bd_net [get_bd_pins or_gate_5/y] [get_bd_pins and_gate_7/a]
connect_bd_net [get_bd_pins xlconstant_0/dout] [get_bd_pins and_gate_0/a]
connect_bd_net [get_bd_pins xor_gate_0/y] [get_bd_pins y]
connect_bd_net [get_bd_pins xor_gate_1/y] [get_bd_pins y1]
connect_bd_net [get_bd_pins xor_gate_2/y] [get_bd_pins y2]
connect_bd_net [get_bd_pins xor_gate_3/y] [get_bd_pins y3]
connect_bd_net [get_bd_pins xor_gate_4/y] [get_bd_pins y4]
connect_bd_net [get_bd_pins xor_gate_5/y] [get_bd_pins y5]
connect_bd_net [get_bd_pins xor_gate_6/y] [get_bd_pins y6]
connect_bd_net [get_bd_pins xor_gate_7/y] [get_bd_pins y7]

current_bd_instance /cmplmt1
connect_bd_net [get_bd_pins b] \
  [get_bd_pins and_gate_1/b] [get_bd_pins and_gate_2/b] [get_bd_pins and_gate_3/b] [get_bd_pins and_gate_4/b] \
  [get_bd_pins and_gate_5/b] [get_bd_pins and_gate_6/b] [get_bd_pins and_gate_7/b] [get_bd_pins and_gate_0/b]
connect_bd_net -net a7_1 [get_bd_pins a7] [get_bd_pins xor_gate_7/a]
connect_bd_net -net adpt_in_0_O [get_bd_pins a] [get_bd_pins and_gate_1/a] [get_bd_pins xor_gate_0/a] [get_bd_pins or_gate_0/a]
connect_bd_net -net adpt_in_0_O1 [get_bd_pins a1] [get_bd_pins xor_gate_1/a] [get_bd_pins or_gate_0/b]
connect_bd_net -net adpt_in_0_O2 [get_bd_pins a2] [get_bd_pins xor_gate_2/a] [get_bd_pins or_gate_1/b]
connect_bd_net -net adpt_in_0_O3 [get_bd_pins a3] [get_bd_pins xor_gate_3/a] [get_bd_pins or_gate_2/b]
connect_bd_net -net adpt_in_0_O4 [get_bd_pins a4] [get_bd_pins xor_gate_4/a] [get_bd_pins or_gate_3/b]
connect_bd_net -net adpt_in_0_O5 [get_bd_pins a5] [get_bd_pins xor_gate_5/a] [get_bd_pins or_gate_4/b]
connect_bd_net -net adpt_in_0_O6 [get_bd_pins a6] [get_bd_pins xor_gate_6/a] [get_bd_pins or_gate_5/b]
connect_bd_net [get_bd_pins and_gate_0/y] [get_bd_pins xor_gate_0/b]
connect_bd_net [get_bd_pins and_gate_1/y] [get_bd_pins xor_gate_1/b]
connect_bd_net [get_bd_pins and_gate_2/y] [get_bd_pins xor_gate_2/b]
connect_bd_net [get_bd_pins and_gate_3/y] [get_bd_pins xor_gate_3/b]
connect_bd_net [get_bd_pins and_gate_4/y] [get_bd_pins xor_gate_4/b]
connect_bd_net [get_bd_pins and_gate_5/y] [get_bd_pins xor_gate_5/b]
connect_bd_net [get_bd_pins and_gate_6/y] [get_bd_pins xor_gate_6/b]
connect_bd_net [get_bd_pins and_gate_7/y] [get_bd_pins xor_gate_7/b]
connect_bd_net [get_bd_pins or_gate_0/y] [get_bd_pins and_gate_2/a] [get_bd_pins or_gate_1/a]
connect_bd_net [get_bd_pins or_gate_1/y] [get_bd_pins and_gate_3/a] [get_bd_pins or_gate_2/a]
connect_bd_net [get_bd_pins or_gate_2/y] [get_bd_pins and_gate_4/a] [get_bd_pins or_gate_3/a]
connect_bd_net [get_bd_pins or_gate_3/y] [get_bd_pins and_gate_5/a] [get_bd_pins or_gate_4/a]
connect_bd_net [get_bd_pins or_gate_4/y] [get_bd_pins and_gate_6/a] [get_bd_pins or_gate_5/a]
connect_bd_net [get_bd_pins or_gate_5/y] [get_bd_pins and_gate_7/a]
connect_bd_net [get_bd_pins xlconstant_0/dout] [get_bd_pins and_gate_0/a]
connect_bd_net [get_bd_pins xor_gate_0/y] [get_bd_pins y]
connect_bd_net [get_bd_pins xor_gate_1/y] [get_bd_pins y1]
connect_bd_net [get_bd_pins xor_gate_2/y] [get_bd_pins y2]
connect_bd_net [get_bd_pins xor_gate_3/y] [get_bd_pins y3]
connect_bd_net [get_bd_pins xor_gate_4/y] [get_bd_pins y4]
connect_bd_net [get_bd_pins xor_gate_5/y] [get_bd_pins y5]
connect_bd_net [get_bd_pins xor_gate_6/y] [get_bd_pins y6]
connect_bd_net [get_bd_pins xor_gate_7/y] [get_bd_pins y7]

current_bd_instance /multi_part
connect_bd_net [get_bd_pins b] \
  [get_bd_pins and_gate_9/b] [get_bd_pins and_gate_10/b] [get_bd_pins and_gate_11/b] [get_bd_pins and_gate_12/b] \
  [get_bd_pins and_gate_13/b] [get_bd_pins and_gate_14/b] [get_bd_pins and_gate_15/b] [get_bd_pins and_gate_8/b]
connect_bd_net [get_bd_pins and_gate_10/y] [get_bd_pins full_add_10/a]
connect_bd_net [get_bd_pins and_gate_11/y] [get_bd_pins full_add_11/a]
connect_bd_net [get_bd_pins and_gate_12/y] [get_bd_pins full_add_12/a]
connect_bd_net [get_bd_pins and_gate_13/y] [get_bd_pins full_add_13/a]
connect_bd_net [get_bd_pins and_gate_14/y] [get_bd_pins full_add_14/a]
connect_bd_net [get_bd_pins and_gate_15/y] [get_bd_pins full_add_15/a]
connect_bd_net [get_bd_pins and_gate_8/y] [get_bd_pins full_add_8/a]
connect_bd_net [get_bd_pins and_gate_9/y] [get_bd_pins full_add_9/a]
connect_bd_net -net cin1_1 [get_bd_pins cin1] [get_bd_pins full_add_15/cin]
connect_bd_net -net cmplmt_y [get_bd_pins a] [get_bd_pins and_gate_8/a]
connect_bd_net -net cmplmt_y1 [get_bd_pins a1] [get_bd_pins and_gate_9/a]
connect_bd_net -net cmplmt_y2 [get_bd_pins a2] [get_bd_pins and_gate_10/a]
connect_bd_net -net cmplmt_y3 [get_bd_pins a3] [get_bd_pins and_gate_11/a]
connect_bd_net -net cmplmt_y4 [get_bd_pins a4] [get_bd_pins and_gate_12/a]
connect_bd_net -net cmplmt_y5 [get_bd_pins a5] [get_bd_pins and_gate_13/a]
connect_bd_net -net cmplmt_y6 [get_bd_pins a6] [get_bd_pins and_gate_14/a]
connect_bd_net -net cmplmt_y7 [get_bd_pins a7] [get_bd_pins and_gate_15/a]
connect_bd_net [get_bd_pins full_add_10/cout] [get_bd_pins full_add_11/cin]
connect_bd_net [get_bd_pins full_add_10/sum] [get_bd_pins sum1]
connect_bd_net [get_bd_pins full_add_11/cout] [get_bd_pins full_add_12/cin]
connect_bd_net [get_bd_pins full_add_11/sum] [get_bd_pins sum2]
connect_bd_net [get_bd_pins full_add_12/cout] [get_bd_pins full_add_13/cin]
connect_bd_net [get_bd_pins full_add_12/sum] [get_bd_pins sum3]
connect_bd_net [get_bd_pins full_add_13/cout] [get_bd_pins full_add_14/cin]
connect_bd_net [get_bd_pins full_add_13/sum] [get_bd_pins sum4]
connect_bd_net [get_bd_pins full_add_14/cout] [get_bd_pins full_add_15/b]
connect_bd_net [get_bd_pins full_add_14/sum] [get_bd_pins sum5]
connect_bd_net [get_bd_pins full_add_15/cout] [get_bd_pins cout]
connect_bd_net [get_bd_pins full_add_15/sum] [get_bd_pins sum6]
connect_bd_net -net full_add_1_sum [get_bd_pins b1] [get_bd_pins full_add_8/b]
connect_bd_net -net full_add_2_sum [get_bd_pins b2] [get_bd_pins full_add_9/b]
connect_bd_net -net full_add_3_sum [get_bd_pins b3] [get_bd_pins full_add_10/b]
connect_bd_net -net full_add_4_sum [get_bd_pins b4] [get_bd_pins full_add_11/b]
connect_bd_net -net full_add_5_sum [get_bd_pins b5] [get_bd_pins full_add_12/b]
connect_bd_net -net full_add_6_sum [get_bd_pins b6] [get_bd_pins full_add_13/b]
connect_bd_net -net full_add_7_sum [get_bd_pins b7] [get_bd_pins full_add_14/b]
connect_bd_net [get_bd_pins full_add_8/cout] [get_bd_pins full_add_9/cin]
connect_bd_net [get_bd_pins full_add_8/sum] [get_bd_pins sum7]
connect_bd_net [get_bd_pins full_add_9/cout] [get_bd_pins full_add_10/cin]
connect_bd_net [get_bd_pins full_add_9/sum] [get_bd_pins sum]
connect_bd_net -net xlconstant_0_dout [get_bd_pins cin] [get_bd_pins full_add_8/cin]

current_bd_instance /multi_head
connect_bd_net [get_bd_pins b] \
  [get_bd_pins and_gate_1/b] [get_bd_pins and_gate_2/b] [get_bd_pins and_gate_3/b] [get_bd_pins and_gate_4/b] \
  [get_bd_pins and_gate_5/b] [get_bd_pins and_gate_6/b] [get_bd_pins and_gate_7/b] [get_bd_pins and_gate_0/b]
connect_bd_net [get_bd_pins and_gate_0/y] [get_bd_pins full_add_0/a]
connect_bd_net [get_bd_pins and_gate_1/y] [get_bd_pins full_add_1/a]
connect_bd_net [get_bd_pins and_gate_2/y] [get_bd_pins full_add_2/a]
connect_bd_net [get_bd_pins and_gate_3/y] [get_bd_pins full_add_3/a]
connect_bd_net [get_bd_pins and_gate_4/y] [get_bd_pins full_add_4/a]
connect_bd_net [get_bd_pins and_gate_5/y] [get_bd_pins full_add_5/a]
connect_bd_net [get_bd_pins and_gate_6/y] [get_bd_pins full_add_6/a]
connect_bd_net [get_bd_pins and_gate_7/y] [get_bd_pins full_add_7/a]
connect_bd_net -net cmplmt_y [get_bd_pins a] [get_bd_pins and_gate_0/a]
connect_bd_net -net cmplmt_y1 [get_bd_pins a1] [get_bd_pins and_gate_1/a]
connect_bd_net -net cmplmt_y2 [get_bd_pins a2] [get_bd_pins and_gate_2/a]
connect_bd_net -net cmplmt_y3 [get_bd_pins a3] [get_bd_pins and_gate_3/a]
connect_bd_net -net cmplmt_y4 [get_bd_pins a4] [get_bd_pins and_gate_4/a]
connect_bd_net -net cmplmt_y5 [get_bd_pins a5] [get_bd_pins and_gate_5/a]
connect_bd_net -net cmplmt_y6 [get_bd_pins a6] [get_bd_pins and_gate_6/a]
connect_bd_net -net cmplmt_y7 [get_bd_pins a7] [get_bd_pins and_gate_7/a]
connect_bd_net [get_bd_pins full_add_0/cout] [get_bd_pins full_add_1/cin]
connect_bd_net [get_bd_pins full_add_0/sum] [get_bd_pins sum7]
connect_bd_net [get_bd_pins full_add_1/cout] [get_bd_pins full_add_2/cin]
connect_bd_net [get_bd_pins full_add_1/sum] [get_bd_pins sum]
connect_bd_net [get_bd_pins full_add_2/cout] [get_bd_pins full_add_3/cin]
connect_bd_net [get_bd_pins full_add_2/sum] [get_bd_pins sum1]
connect_bd_net [get_bd_pins full_add_3/cout] [get_bd_pins full_add_4/cin]
connect_bd_net [get_bd_pins full_add_3/sum] [get_bd_pins sum2]
connect_bd_net [get_bd_pins full_add_4/cout] [get_bd_pins full_add_5/cin]
connect_bd_net [get_bd_pins full_add_4/sum] [get_bd_pins sum3]
connect_bd_net [get_bd_pins full_add_5/cout] [get_bd_pins full_add_6/cin]
connect_bd_net [get_bd_pins full_add_5/sum] [get_bd_pins sum4]
connect_bd_net [get_bd_pins full_add_6/cout] [get_bd_pins full_add_7/b]
connect_bd_net [get_bd_pins full_add_6/sum] [get_bd_pins sum5]
connect_bd_net [get_bd_pins full_add_7/cout] [get_bd_pins cout]
connect_bd_net [get_bd_pins full_add_7/sum] [get_bd_pins sum6]
connect_bd_net -net xlconstant_0_dout [get_bd_pins b1] \
  [get_bd_pins full_add_1/b] [get_bd_pins full_add_2/b] [get_bd_pins full_add_3/b] [get_bd_pins full_add_4/b] \
  [get_bd_pins full_add_5/b] [get_bd_pins full_add_6/b] [get_bd_pins full_add_0/b]

current_bd_instance /multi_part2
connect_bd_net [get_bd_pins b] \
  [get_bd_pins and_gate_9/b] [get_bd_pins and_gate_10/b] [get_bd_pins and_gate_11/b] [get_bd_pins and_gate_12/b] \
  [get_bd_pins and_gate_13/b] [get_bd_pins and_gate_14/b] [get_bd_pins and_gate_15/b] [get_bd_pins and_gate_8/b]
connect_bd_net [get_bd_pins and_gate_10/y] [get_bd_pins full_add_10/a]
connect_bd_net [get_bd_pins and_gate_11/y] [get_bd_pins full_add_11/a]
connect_bd_net [get_bd_pins and_gate_12/y] [get_bd_pins full_add_12/a]
connect_bd_net [get_bd_pins and_gate_13/y] [get_bd_pins full_add_13/a]
connect_bd_net [get_bd_pins and_gate_14/y] [get_bd_pins full_add_14/a]
connect_bd_net [get_bd_pins and_gate_15/y] [get_bd_pins full_add_15/a]
connect_bd_net [get_bd_pins and_gate_8/y] [get_bd_pins full_add_8/a]
connect_bd_net [get_bd_pins and_gate_9/y] [get_bd_pins full_add_9/a]
connect_bd_net -net cin1_1 [get_bd_pins cin1] [get_bd_pins full_add_15/cin]
connect_bd_net -net cmplmt_y [get_bd_pins a] [get_bd_pins and_gate_8/a]
connect_bd_net -net cmplmt_y1 [get_bd_pins a1] [get_bd_pins and_gate_9/a]
connect_bd_net -net cmplmt_y2 [get_bd_pins a2] [get_bd_pins and_gate_10/a]
connect_bd_net -net cmplmt_y3 [get_bd_pins a3] [get_bd_pins and_gate_11/a]
connect_bd_net -net cmplmt_y4 [get_bd_pins a4] [get_bd_pins and_gate_12/a]
connect_bd_net -net cmplmt_y5 [get_bd_pins a5] [get_bd_pins and_gate_13/a]
connect_bd_net -net cmplmt_y6 [get_bd_pins a6] [get_bd_pins and_gate_14/a]
connect_bd_net -net cmplmt_y7 [get_bd_pins a7] [get_bd_pins and_gate_15/a]
connect_bd_net [get_bd_pins full_add_10/cout] [get_bd_pins full_add_11/cin]
connect_bd_net [get_bd_pins full_add_10/sum] [get_bd_pins sum1]
connect_bd_net [get_bd_pins full_add_11/cout] [get_bd_pins full_add_12/cin]
connect_bd_net [get_bd_pins full_add_11/sum] [get_bd_pins sum2]
connect_bd_net [get_bd_pins full_add_12/cout] [get_bd_pins full_add_13/cin]
connect_bd_net [get_bd_pins full_add_12/sum] [get_bd_pins sum3]
connect_bd_net [get_bd_pins full_add_13/cout] [get_bd_pins full_add_14/cin]
connect_bd_net [get_bd_pins full_add_13/sum] [get_bd_pins sum4]
connect_bd_net [get_bd_pins full_add_14/cout] [get_bd_pins full_add_15/b]
connect_bd_net [get_bd_pins full_add_14/sum] [get_bd_pins sum5]
connect_bd_net [get_bd_pins full_add_15/cout] [get_bd_pins cout]
connect_bd_net [get_bd_pins full_add_15/sum] [get_bd_pins sum6]
connect_bd_net -net full_add_1_sum [get_bd_pins b1] [get_bd_pins full_add_8/b]
connect_bd_net -net full_add_2_sum [get_bd_pins b2] [get_bd_pins full_add_9/b]
connect_bd_net -net full_add_3_sum [get_bd_pins b3] [get_bd_pins full_add_10/b]
connect_bd_net -net full_add_4_sum [get_bd_pins b4] [get_bd_pins full_add_11/b]
connect_bd_net -net full_add_5_sum [get_bd_pins b5] [get_bd_pins full_add_12/b]
connect_bd_net -net full_add_6_sum [get_bd_pins b6] [get_bd_pins full_add_13/b]
connect_bd_net -net full_add_7_sum [get_bd_pins b7] [get_bd_pins full_add_14/b]
connect_bd_net [get_bd_pins full_add_8/cout] [get_bd_pins full_add_9/cin]
connect_bd_net [get_bd_pins full_add_8/sum] [get_bd_pins sum7]
connect_bd_net [get_bd_pins full_add_9/cout] [get_bd_pins full_add_10/cin]
connect_bd_net [get_bd_pins full_add_9/sum] [get_bd_pins sum]
connect_bd_net -net xlconstant_0_dout [get_bd_pins cin] [get_bd_pins full_add_8/cin]

current_bd_instance /multi_part3
connect_bd_net [get_bd_pins b] \
  [get_bd_pins and_gate_9/b] [get_bd_pins and_gate_10/b] [get_bd_pins and_gate_11/b] [get_bd_pins and_gate_12/b] \
  [get_bd_pins and_gate_13/b] [get_bd_pins and_gate_14/b] [get_bd_pins and_gate_15/b] [get_bd_pins and_gate_8/b]
connect_bd_net [get_bd_pins and_gate_10/y] [get_bd_pins full_add_10/a]
connect_bd_net [get_bd_pins and_gate_11/y] [get_bd_pins full_add_11/a]
connect_bd_net [get_bd_pins and_gate_12/y] [get_bd_pins full_add_12/a]
connect_bd_net [get_bd_pins and_gate_13/y] [get_bd_pins full_add_13/a]
connect_bd_net [get_bd_pins and_gate_14/y] [get_bd_pins full_add_14/a]
connect_bd_net [get_bd_pins and_gate_15/y] [get_bd_pins full_add_15/a]
connect_bd_net [get_bd_pins and_gate_8/y] [get_bd_pins full_add_8/a]
connect_bd_net [get_bd_pins and_gate_9/y] [get_bd_pins full_add_9/a]
connect_bd_net -net cin1_1 [get_bd_pins cin1] [get_bd_pins full_add_15/cin]
connect_bd_net -net cmplmt_y [get_bd_pins a] [get_bd_pins and_gate_8/a]
connect_bd_net -net cmplmt_y1 [get_bd_pins a1] [get_bd_pins and_gate_9/a]
connect_bd_net -net cmplmt_y2 [get_bd_pins a2] [get_bd_pins and_gate_10/a]
connect_bd_net -net cmplmt_y3 [get_bd_pins a3] [get_bd_pins and_gate_11/a]
connect_bd_net -net cmplmt_y4 [get_bd_pins a4] [get_bd_pins and_gate_12/a]
connect_bd_net -net cmplmt_y5 [get_bd_pins a5] [get_bd_pins and_gate_13/a]
connect_bd_net -net cmplmt_y6 [get_bd_pins a6] [get_bd_pins and_gate_14/a]
connect_bd_net -net cmplmt_y7 [get_bd_pins a7] [get_bd_pins and_gate_15/a]
connect_bd_net [get_bd_pins full_add_10/cout] [get_bd_pins full_add_11/cin]
connect_bd_net [get_bd_pins full_add_10/sum] [get_bd_pins sum1]
connect_bd_net [get_bd_pins full_add_11/cout] [get_bd_pins full_add_12/cin]
connect_bd_net [get_bd_pins full_add_11/sum] [get_bd_pins sum2]
connect_bd_net [get_bd_pins full_add_12/cout] [get_bd_pins full_add_13/cin]
connect_bd_net [get_bd_pins full_add_12/sum] [get_bd_pins sum3]
connect_bd_net [get_bd_pins full_add_13/cout] [get_bd_pins full_add_14/cin]
connect_bd_net [get_bd_pins full_add_13/sum] [get_bd_pins sum4]
connect_bd_net [get_bd_pins full_add_14/cout] [get_bd_pins full_add_15/b]
connect_bd_net [get_bd_pins full_add_14/sum] [get_bd_pins sum5]
connect_bd_net [get_bd_pins full_add_15/cout] [get_bd_pins cout]
connect_bd_net [get_bd_pins full_add_15/sum] [get_bd_pins sum6]
connect_bd_net -net full_add_1_sum [get_bd_pins b1] [get_bd_pins full_add_8/b]
connect_bd_net -net full_add_2_sum [get_bd_pins b2] [get_bd_pins full_add_9/b]
connect_bd_net -net full_add_3_sum [get_bd_pins b3] [get_bd_pins full_add_10/b]
connect_bd_net -net full_add_4_sum [get_bd_pins b4] [get_bd_pins full_add_11/b]
connect_bd_net -net full_add_5_sum [get_bd_pins b5] [get_bd_pins full_add_12/b]
connect_bd_net -net full_add_6_sum [get_bd_pins b6] [get_bd_pins full_add_13/b]
connect_bd_net -net full_add_7_sum [get_bd_pins b7] [get_bd_pins full_add_14/b]
connect_bd_net [get_bd_pins full_add_8/cout] [get_bd_pins full_add_9/cin]
connect_bd_net [get_bd_pins full_add_8/sum] [get_bd_pins sum7]
connect_bd_net [get_bd_pins full_add_9/cout] [get_bd_pins full_add_10/cin]
connect_bd_net [get_bd_pins full_add_9/sum] [get_bd_pins sum]
connect_bd_net -net xlconstant_0_dout [get_bd_pins cin] [get_bd_pins full_add_8/cin]

current_bd_instance /multi_part4
connect_bd_net [get_bd_pins b] \
  [get_bd_pins and_gate_9/b] [get_bd_pins and_gate_10/b] [get_bd_pins and_gate_11/b] [get_bd_pins and_gate_12/b] \
  [get_bd_pins and_gate_13/b] [get_bd_pins and_gate_14/b] [get_bd_pins and_gate_15/b] [get_bd_pins and_gate_8/b]
connect_bd_net [get_bd_pins and_gate_10/y] [get_bd_pins full_add_10/a]
connect_bd_net [get_bd_pins and_gate_11/y] [get_bd_pins full_add_11/a]
connect_bd_net [get_bd_pins and_gate_12/y] [get_bd_pins full_add_12/a]
connect_bd_net [get_bd_pins and_gate_13/y] [get_bd_pins full_add_13/a]
connect_bd_net [get_bd_pins and_gate_14/y] [get_bd_pins full_add_14/a]
connect_bd_net [get_bd_pins and_gate_15/y] [get_bd_pins full_add_15/a]
connect_bd_net [get_bd_pins and_gate_8/y] [get_bd_pins full_add_8/a]
connect_bd_net [get_bd_pins and_gate_9/y] [get_bd_pins full_add_9/a]
connect_bd_net -net cin1_1 [get_bd_pins cin1] [get_bd_pins full_add_15/cin]
connect_bd_net -net cmplmt_y [get_bd_pins a] [get_bd_pins and_gate_8/a]
connect_bd_net -net cmplmt_y1 [get_bd_pins a1] [get_bd_pins and_gate_9/a]
connect_bd_net -net cmplmt_y2 [get_bd_pins a2] [get_bd_pins and_gate_10/a]
connect_bd_net -net cmplmt_y3 [get_bd_pins a3] [get_bd_pins and_gate_11/a]
connect_bd_net -net cmplmt_y4 [get_bd_pins a4] [get_bd_pins and_gate_12/a]
connect_bd_net -net cmplmt_y5 [get_bd_pins a5] [get_bd_pins and_gate_13/a]
connect_bd_net -net cmplmt_y6 [get_bd_pins a6] [get_bd_pins and_gate_14/a]
connect_bd_net -net cmplmt_y7 [get_bd_pins a7] [get_bd_pins and_gate_15/a]
connect_bd_net [get_bd_pins full_add_10/cout] [get_bd_pins full_add_11/cin]
connect_bd_net [get_bd_pins full_add_10/sum] [get_bd_pins sum1]
connect_bd_net [get_bd_pins full_add_11/cout] [get_bd_pins full_add_12/cin]
connect_bd_net [get_bd_pins full_add_11/sum] [get_bd_pins sum2]
connect_bd_net [get_bd_pins full_add_12/cout] [get_bd_pins full_add_13/cin]
connect_bd_net [get_bd_pins full_add_12/sum] [get_bd_pins sum3]
connect_bd_net [get_bd_pins full_add_13/cout] [get_bd_pins full_add_14/cin]
connect_bd_net [get_bd_pins full_add_13/sum] [get_bd_pins sum4]
connect_bd_net [get_bd_pins full_add_14/cout] [get_bd_pins full_add_15/b]
connect_bd_net [get_bd_pins full_add_14/sum] [get_bd_pins sum5]
connect_bd_net [get_bd_pins full_add_15/cout] [get_bd_pins cout]
connect_bd_net [get_bd_pins full_add_15/sum] [get_bd_pins sum6]
connect_bd_net -net full_add_1_sum [get_bd_pins b1] [get_bd_pins full_add_8/b]
connect_bd_net -net full_add_2_sum [get_bd_pins b2] [get_bd_pins full_add_9/b]
connect_bd_net -net full_add_3_sum [get_bd_pins b3] [get_bd_pins full_add_10/b]
connect_bd_net -net full_add_4_sum [get_bd_pins b4] [get_bd_pins full_add_11/b]
connect_bd_net -net full_add_5_sum [get_bd_pins b5] [get_bd_pins full_add_12/b]
connect_bd_net -net full_add_6_sum [get_bd_pins b6] [get_bd_pins full_add_13/b]
connect_bd_net -net full_add_7_sum [get_bd_pins b7] [get_bd_pins full_add_14/b]
connect_bd_net [get_bd_pins full_add_8/cout] [get_bd_pins full_add_9/cin]
connect_bd_net [get_bd_pins full_add_8/sum] [get_bd_pins sum7]
connect_bd_net [get_bd_pins full_add_9/cout] [get_bd_pins full_add_10/cin]
connect_bd_net [get_bd_pins full_add_9/sum] [get_bd_pins sum]
connect_bd_net -net xlconstant_0_dout [get_bd_pins cin] [get_bd_pins full_add_8/cin]
